# EAGLE design Brakeout board - wire connection (EAGLE 9.6.2)
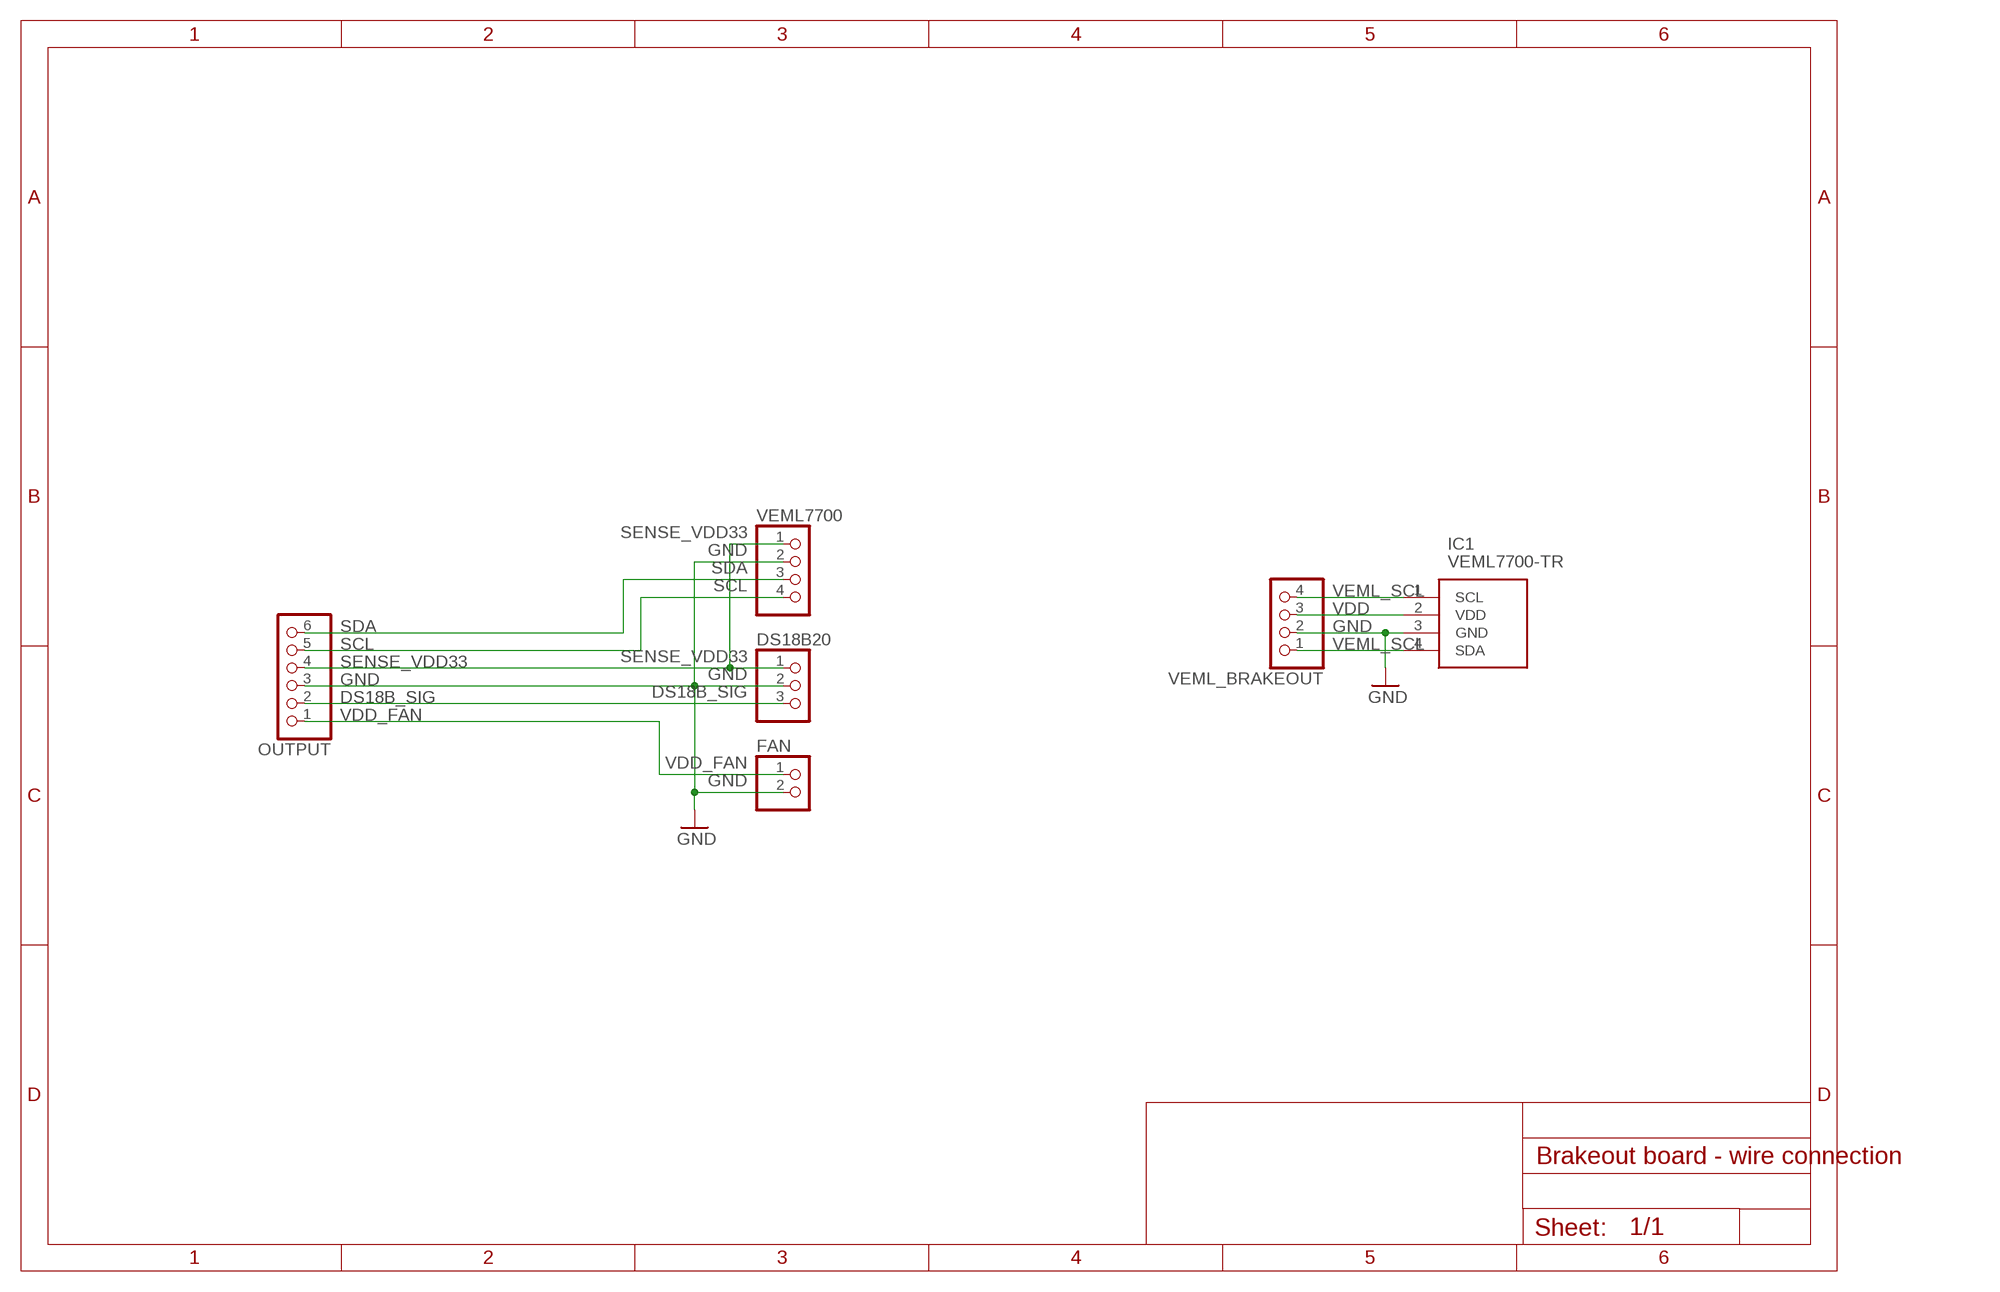
[diagram p0: schematic, sheet 1]

## Parts
DS18B20  PINHD-1X3  [1X03]
FAN  PINHD-1X2  [1X02]
IC1  VEML7700-TR  [VEML7700]
OUTPUT  PINHD-1X6  [1X06]
VEML7700  PINHD-1X4  [1X04]
VEML_BRAKEOUT  PINHD-1X4  [1X04]

## Nets
DS18B_SIG: DS18B20.3 OUTPUT.2
GND: DS18B20.2 FAN.2 IC1.3(GND) OUTPUT.3 VEML7700.2 VEML_BRAKEOUT.2
SCL: OUTPUT.5 VEML7700.4
SDA: OUTPUT.6 VEML7700.3
SENSE_VDD33: DS18B20.1 OUTPUT.4 VEML7700.1
VDD: IC1.2(VDD) VEML_BRAKEOUT.3
VDD_FAN: FAN.1 OUTPUT.1
VEML_SCL: IC1.1(SCL) IC1.4(SDA) VEML_BRAKEOUT.1 VEML_BRAKEOUT.4

## Library data of the parts
DS18B20 = pinhead:PINHD-1X3: PIN HEADER
FAN = pinhead:PINHD-1X2: PIN HEADER
IC1 = 1-component-search:VEML7700-TR: High Accuracy Ambient Light Sensor with I2C Interface Source: Datasheet <http://www.vishay.com/docs/84286/veml7700.pdf>; ARROW_PART_NUMBER: VEML7700-TR; ARROW_PRICE-STOCK: https://www.arrow.com/en/products/veml7700-tr/vishay?region=nac; DESCRIPTION: High Accuracy Ambient Light Sensor with I2C Interface; HEIGHT: mm; MANUFACTURER_NAME: Vishay; MANUFACTURER_PART_NUMBER: VEML7700-TR; MOUSER_PART_NUMBER: 78-VEML7700-TR; MOUSER_PRICE-STOCK: https://www.mouser.co.uk/ProductDetail/Vishay-Semiconductors/VEML7700-TR?qs=BcfjnG7NVaWcZHs8m27pyQ%3D%3D
OUTPUT = pinhead:PINHD-1X6: PIN HEADER
VEML7700 VEML_BRAKEOUT = pinhead:PINHD-1X4: PIN HEADER

## Board
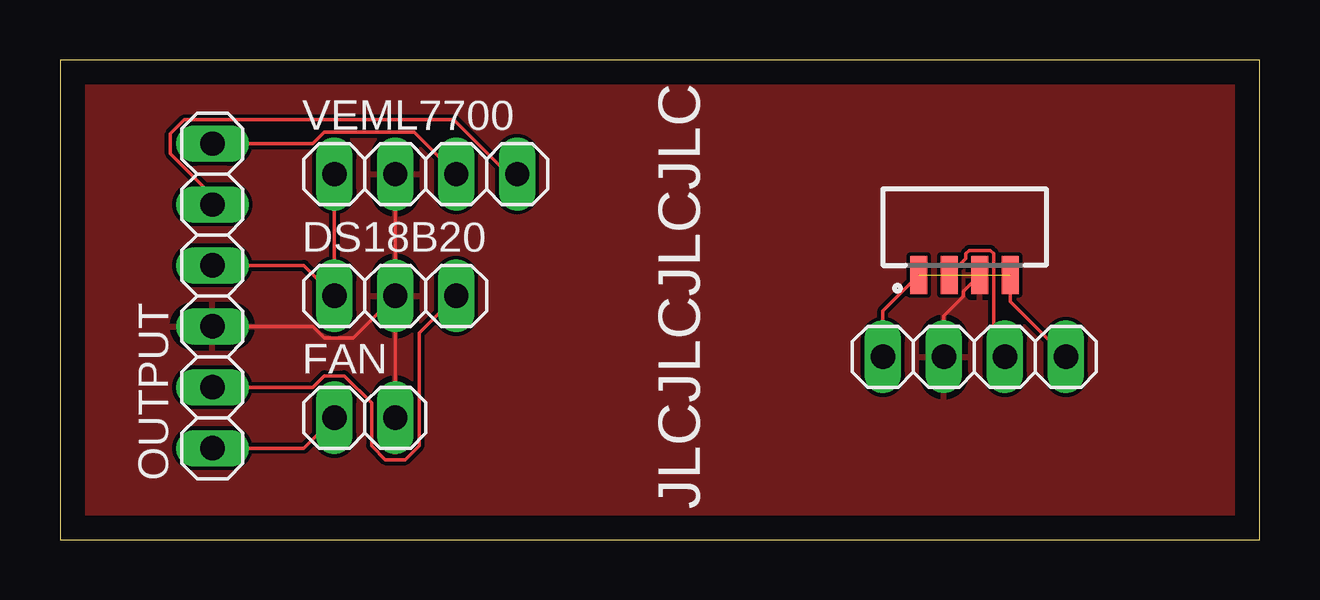
[diagram p1: board, top side]
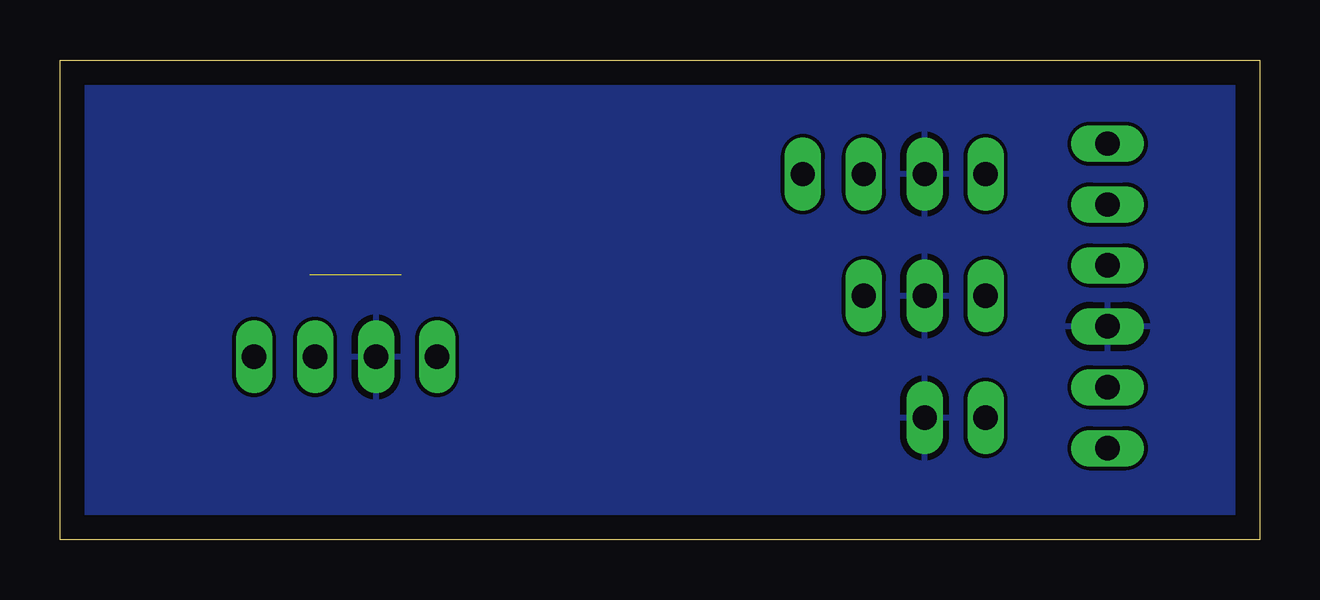
[diagram p2: board, bottom side, seen from below]

Size 50 x 20 mm. Coordinates in mm from the lower left corner, seen from the top.
Outline: 0,0 50,0 50,20 0,20 0,0
Copper layers (1*16): Top 0.035mm / dielectric 1.5mm / Bottom 0.035mm
Design rules "default": minimum track width 6mil, minimum drill 0.35mm, track to track 6mil, track to pad 6mil, pad to pad 6mil, via to via 6mil, smd to smd 6mil, copper to edge 40mil, drill to drill 6mil, minimum pad ring 10mil, minimum via ring 8mil, stop-mask expansion 4mil, vias tented up to drill 0mil, thermal gap 10mil

### Footprints (pad centres in the part's own frame; a part is rotated, then mirrored left to right if it is on the bottom)
1X03 = drill 1.016 long: 1 -2.54,0; 2 0,0; 3 2.54,0
1X02 = drill 1.016 long: 1 -1.27,0; 2 1.27,0
VEML7700 = smd 0.7 x 1.6: 1 1.495,-0.4; 2 2.765,-0.4; 3 4.035,-0.4; 4 5.305,-0.4
1X06 = drill 1.016 long: 1 -6.35,0; 2 -3.81,0; 3 -1.27,0; 4 1.27,0; 5 3.81,0; 6 6.35,0
1X04 = drill 1.016 long: 1 -3.81,0; 2 -1.27,0; 3 1.27,0; 4 3.81,0

### Placement (x,y rotation side)
DS18B20  13.97,10.16 0 top
FAN  12.7,5.08 0 top
IC1  34.29,11.43 0 top
OUTPUT  6.35,10.16 90 top
VEML7700  15.24,15.24 0 top
VEML_BRAKEOUT  38.1,7.62 0 top

### Tracks (layer width: path | path; a pad name or v marks a point on that pad's centre or on a via)
DS18B_SIG
  Top 0.152: OUTPUT.2 10.54,6.35 11.02,6.83 11.84,6.83 12.98,5.69 12.98,3.91 13.56,3.33 14.38,3.33 14.96,3.91 14.96,8.61 DS18B20.3
GND
  Top 0.152: OUTPUT.3 10.54,8.89 11.02,8.41 12.22,8.41 DS18B20.2 | DS18B20.2 VEML7700.2 | DS18B20.2 FAN.2 | IC1.3 37.63,10.34 37.63,10.13 36.83,9.33 VEML_BRAKEOUT.2
  pour Top: 0,0 0,20.32 50.8,20.32 50.8,0
  pour Bottom: 0,0 0,20.32 50.8,20.32 50.8,0
SCL
  Top 0.152: VEML7700.4 18.67,15.24 16.41,17.5 5.18,17.5 4.6,16.92 4.6,16.1 6.35,14.35 OUTPUT.5
SDA
  Top 0.152: VEML7700.3 14.76,16.99 11.02,16.99 10.54,16.51 OUTPUT.6
SENSE_VDD33
  Top 0.152: OUTPUT.4 10.16,11.43 DS18B20.1 VEML7700.1
VDD
  Top 0.152: VEML_BRAKEOUT.3 38.9,8.09 38.9,11.93 38.77,12.06 37.88,12.06 37.75,11.93 37.75,11.72 IC1.2
VDD_FAN
  Top 0.152: FAN.1 10.16,3.81 OUTPUT.1
VEML_SCL  (1 unrouted)
  Top 0.152: VEML_BRAKEOUT.1 34.29,9.54 IC1.1 | VEML_BRAKEOUT.4 39.59,9.94 IC1.4

### Text on the board
tNames: JLCJLCJLCJLC